# Altium schematic sheet Power_regulator.SchDoc
size A; DocumentNumber: 3; SheetNumber: 3; SheetTotal: 5
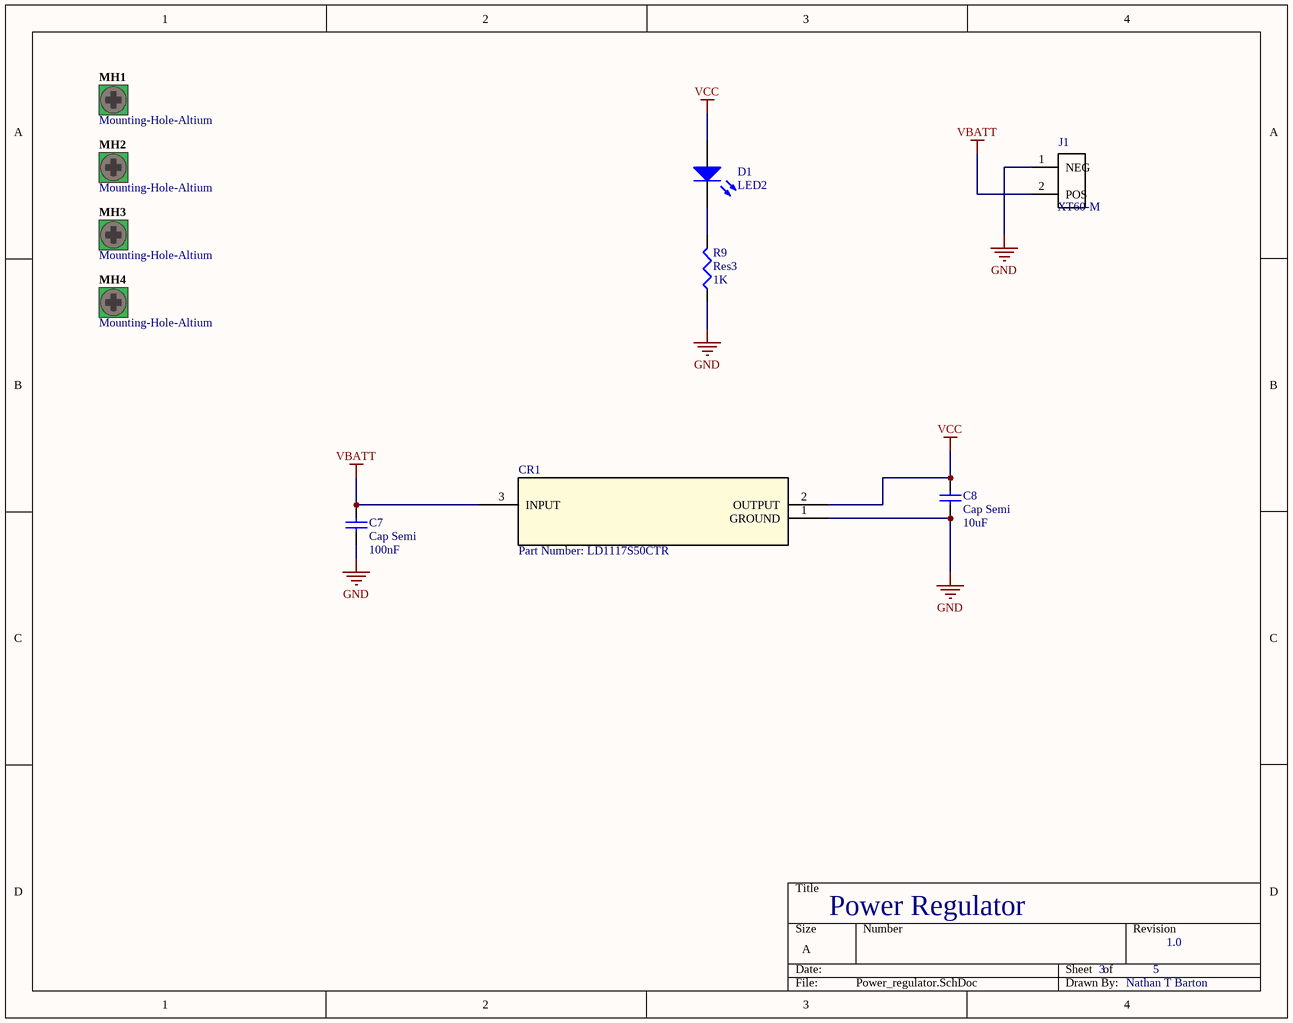
[diagram p0: Power_regulator.SchDoc]

## Parts
C7  Cap Semi  value 100nF  [C1206]
C8  Cap Semi  value 10uF  [C1206]
CR1  Part Number: LD1117S50CTR  [SOT-223]
D1  LED2  [3.2X1.6X1.1]
J1  XT60-M  [*AMASS_XT60-M]
MH1  Mounting-Hole-Altium  [Mounting-Hole-Altium]  (no BOM)
MH2  Mounting-Hole-Altium  [Mounting-Hole-Altium]  (no BOM)
MH3  Mounting-Hole-Altium  [Mounting-Hole-Altium]  (no BOM)
MH4  Mounting-Hole-Altium  [Mounting-Hole-Altium]  (no BOM)
R9  Res3  value 1K  [J1-0603]

## Nets
GND: C7.1 C8.1 CR1.1(GROUND) J1.1(NEG) R9.1
VBATT: C7.2 CR1.3(INPUT) J1.2(POS)
VCC: C8.2 CR1.2(OUTPUT) D1.1(A)
NetD1_2: D1.2(K) R9.2

Not connected (* = marked no-connect by the designer): MH1 1; MH2 1; MH3 1; MH4 1

## Notes on the sheet
- Power Regulator
- 3
- 5
- 1.0
- Nathan T Barton

## Library data of the parts
C7 C8 = Cap Semi: Capacitor (Semiconductor SIM Model); Published: 8-Jun-2000; LatestRevisionDate: 29-May-2009; LatestRevisionNote: IPC-7351 Footprint Added.; PackageReference: C1206; Publisher: Altium Limited; PackageDescription: Chip Capacitor
CR1 = LD1117S50CTR: No Description Available; Vendor: STMicroelectronics; Built_By: EMA_UL_Team; Type: DEV; Manufacturer_Part_Number: LD1117S50CTR; Copyright: Copyright (C) 2018 Accelerated Designs. All rights reserved; RefDes: RefDes; Value: Value
D1 = LED2: Typical RED, GREEN, YELLOW, AMBER GaAs LED; Published: 8-Jun-2000; LatestRevisionDate: 17-Jul-2002; LatestRevisionNote: Re-released for DXP Platform.; PackageVersion: Feb-2002; PackageReference: 3.2X1.6X1.1; Publisher: Altium Limited; PackageDescription: SM LED; 2 Flat Leads
J1 = XT60-M: MF: AMASS; Availability: Unavailable; Package: Package Analog Devices; SnapEDA_Link: https://www.snapeda.com/parts/XT60-M/AMASS/view-part/?ref=snap; MP: XT60-M; Price: None; Value: *
MH1-MH4 = CMP-0001-00027-1: Mounting Hole, Altium, 3.8mm pad, 3.4mm plated hole; ClassName: Mounting Hole; Publisher: Altium
R9 = Res3: Resistor; Published: 8-Jun-2000; LatestRevisionDate: 29-May-2009; LatestRevisionNote: IPC-7351 Footprint Added.; PackageReference: J1-0603; Publisher: Altium Limited; PackageDescription: Chip Resistor